# Altium schematic sheet ep4ce30_a.SchDoc: EP4CE30F23 - A
size OrCAD B; CheckedBy: liuchao; DrawnBy: liuchao; DocumentNumber: APEX-USB1; Revision: 3.0.0; SheetNumber: 1; SheetTotal: 9
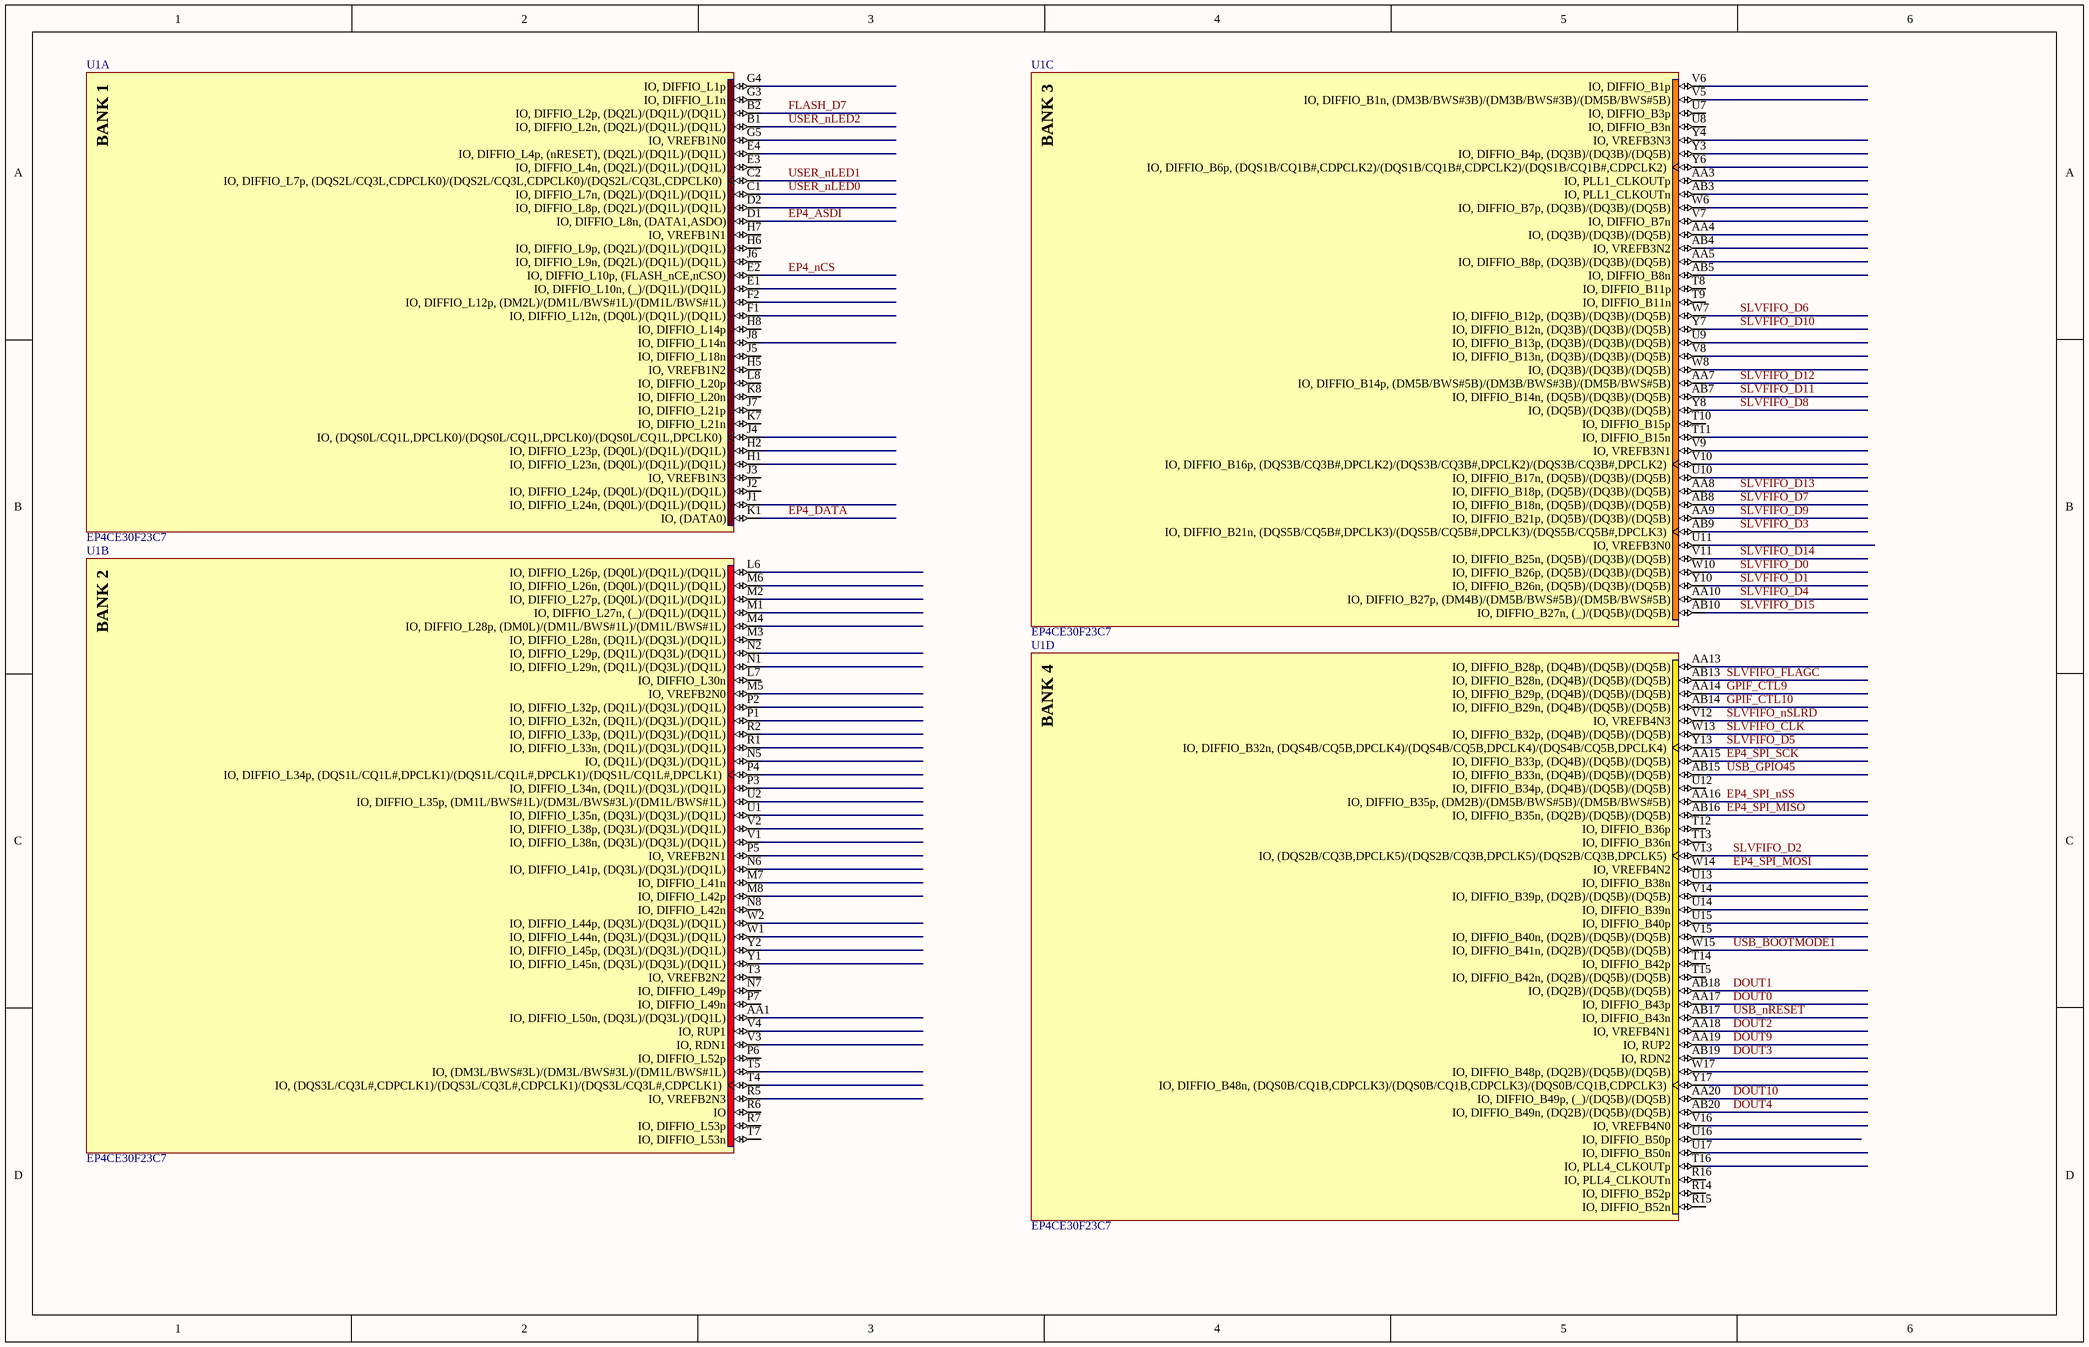
[diagram p0: ep4ce30_a.SchDoc]

## Parts
U1  EP4CE30F23C7  [FBGA484_A-240]  (parts A,B,C,D of 13)

## Nets
DOUT0: U1.AA17(IO,_DIFFIO_B43p)
DOUT1: U1.AB18(IO,_(DQ2B)/(DQ5B)/(DQ5B))
DOUT2: U1.AA18(IO,_VREFB4N1)
DOUT3: U1.AB19(IO,_RDN2)
DOUT4: U1.AB20(IO,_DIFFIO_B49n,_(DQ2B)/(DQ5B)/(DQ5B))
DOUT9: U1.AA19(IO,_RUP2)
DOUT10: U1.AA20(IO,_DIFFIO_B49p,_(_)/(DQ5B)/(DQ5B))
EP4_ASDI: U1.D1(IO,_DIFFIO_L8n,_(DATA1,ASDO))
EP4_DATA: U1.K1(IO,_(DATA0))
EP4_nCS: U1.E2(IO,_DIFFIO_L10p,_(FLASH_nCE,nCSO))
EP4_SPI_MISO: U1.AB16(IO,_DIFFIO_B35n,_(DQ2B)/(DQ5B)/(DQ5B))
EP4_SPI_MOSI: U1.W14(IO,_VREFB4N2)
EP4_SPI_nSS: U1.AA16(IO,_DIFFIO_B35p,_(DM2B)/(DM5B/BWS#5B)/(DM5B/BWS#5B))
EP4_SPI_SCK: U1.AA15(IO,_DIFFIO_B33p,_(DQ4B)/(DQ5B)/(DQ5B))
FLASH_D7: U1.B2(IO,_DIFFIO_L2p,_(DQ2L)/(DQ1L)/(DQ1L))
GPIF_CTL9: U1.AA14(IO,_DIFFIO_B29p,_(DQ4B)/(DQ5B)/(DQ5B))
GPIF_CTL10: U1.AB14(IO,_DIFFIO_B29n,_(DQ4B)/(DQ5B)/(DQ5B))
SLVFIFO_CLK: U1.W13(IO,_DIFFIO_B32p,_(DQ4B)/(DQ5B)/(DQ5B))
SLVFIFO_D0: U1.W10(IO,_DIFFIO_B26p,_(DQ5B)/(DQ3B)/(DQ5B))
SLVFIFO_D1: U1.Y10(IO,_DIFFIO_B26n,_(DQ5B)/(DQ3B)/(DQ5B))
SLVFIFO_D2: U1.V13(IO,_(DQS2B/CQ3B,DPCLK5)/(DQS2B/CQ3B,DPCLK5)/(DQS2B/CQ3B,DPCLK5))
SLVFIFO_D3: U1.AB9(IO,_DIFFIO_B21n,_(DQS5B/CQ5B#,DPCLK3)/(DQS5B/CQ5B#,DPCLK3)/(DQS5B/CQ5B#,DPCLK3))
SLVFIFO_D4: U1.AA10(IO,_DIFFIO_B27p,_(DM4B)/(DM5B/BWS#5B)/(DM5B/BWS#5B))
SLVFIFO_D5: U1.Y13(IO,_DIFFIO_B32n,_(DQS4B/CQ5B,DPCLK4)/(DQS4B/CQ5B,DPCLK4)/(DQS4B/CQ5B,DPCLK4))
SLVFIFO_D6: U1.W7(IO,_DIFFIO_B12p,_(DQ3B)/(DQ3B)/(DQ5B))
SLVFIFO_D7: U1.AB8(IO,_DIFFIO_B18n,_(DQ5B)/(DQ3B)/(DQ5B))
SLVFIFO_D8: U1.Y8(IO,_(DQ5B)/(DQ3B)/(DQ5B))
SLVFIFO_D9: U1.AA9(IO,_DIFFIO_B21p,_(DQ5B)/(DQ3B)/(DQ5B))
SLVFIFO_D10: U1.Y7(IO,_DIFFIO_B12n,_(DQ3B)/(DQ3B)/(DQ5B))
SLVFIFO_D11: U1.AB7(IO,_DIFFIO_B14n,_(DQ5B)/(DQ3B)/(DQ5B))
SLVFIFO_D12: U1.AA7(IO,_DIFFIO_B14p,_(DM5B/BWS#5B)/(DM3B/BWS#3B)/(DM5B/BWS#5B))
SLVFIFO_D13: U1.AA8(IO,_DIFFIO_B18p,_(DQ5B)/(DQ3B)/(DQ5B))
SLVFIFO_D14: U1.V11(IO,_DIFFIO_B25n,_(DQ5B)/(DQ3B)/(DQ5B))
SLVFIFO_D15: U1.AB10(IO,_DIFFIO_B27n,_(_)/(DQ5B)/(DQ5B))
SLVFIFO_FLAGC: U1.AB13(IO,_DIFFIO_B28n,_(DQ4B)/(DQ5B)/(DQ5B))
SLVFIFO_nSLRD: U1.V12(IO,_VREFB4N3)
USB_BOOTMODE1: U1.W15(IO,_DIFFIO_B41n,_(DQ2B)/(DQ5B)/(DQ5B))
USB_GPIO45: U1.AB15(IO,_DIFFIO_B33n,_(DQ4B)/(DQ5B)/(DQ5B))
USB_nRESET: U1.AB17(IO,_DIFFIO_B43n)
USER_nLED0: U1.C1(IO,_DIFFIO_L7n,_(DQ2L)/(DQ1L)/(DQ1L))
USER_nLED1: U1.C2(IO,_DIFFIO_L7p,_(DQS2L/CQ3L,CDPCLK0)/(DQS2L/CQ3L,CDPCLK0)/(DQS2L/CQ3L,CDPCLK0))
USER_nLED2: U1.B1(IO,_DIFFIO_L2n,_(DQ2L)/(DQ1L)/(DQ1L))

Not connected (* = marked no-connect by the designer): U1 AA1(IO,_DIFFIO_L50n,_(DQ3L)/(DQ3L)/(DQ1L)) AA3(IO,_PLL1_CLKOUTp) AA4(IO,_(DQ3B)/(DQ3B)/(DQ5B)) AA5(IO,_DIFFIO_B8p,_(DQ3B)/(DQ3B)/(DQ5B)) AA13(IO,_DIFFIO_B28p,_(DQ4B)/(DQ5B)/(DQ5B)) AB3(IO,_PLL1_CLKOUTn) AB4(IO,_VREFB3N2) AB5(IO,_DIFFIO_B8n) D2(IO,_DIFFIO_L8p,_(DQ2L)/(DQ1L)/(DQ1L)) E1(IO,_DIFFIO_L10n,_(_)/(DQ1L)/(DQ1L)) E3(IO,_DIFFIO_L4n,_(DQ2L)/(DQ1L)/(DQ1L)) E4(IO,_DIFFIO_L4p,_(nRESET),_(DQ2L)/(DQ1L)/(DQ1L)) F1(IO,_DIFFIO_L12n,_(DQ0L)/(DQ1L)/(DQ1L)) F2(IO,_DIFFIO_L12p,_(DM2L)/(DM1L/BWS#1L)/(DM1L/BWS#1L)) G3(IO,_DIFFIO_L1n) G4(IO,_DIFFIO_L1p) G5(IO,_VREFB1N0) H1(IO,_DIFFIO_L23n,_(DQ0L)/(DQ1L)/(DQ1L)) H2(IO,_DIFFIO_L23p,_(DQ0L)/(DQ1L)/(DQ1L)) H5(IO,_VREFB1N2) H6(IO,_DIFFIO_L9p,_(DQ2L)/(DQ1L)/(DQ1L)) H7(IO,_VREFB1N1) H8(IO,_DIFFIO_L14p) J1(IO,_DIFFIO_L24n,_(DQ0L)/(DQ1L)/(DQ1L)) J2(IO,_DIFFIO_L24p,_(DQ0L)/(DQ1L)/(DQ1L)) J3(IO,_VREFB1N3) J4(IO,_(DQS0L/CQ1L,DPCLK0)/(DQS0L/CQ1L,DPCLK0)/(DQS0L/CQ1L,DPCLK0)) J5(IO,_DIFFIO_L18n) J6(IO,_DIFFIO_L9n,_(DQ2L)/(DQ1L)/(DQ1L)) J7(IO,_DIFFIO_L21p) J8(IO,_DIFFIO_L14n) K7(IO,_DIFFIO_L21n) K8(IO,_DIFFIO_L20n) L6(IO,_DIFFIO_L26p,_(DQ0L)/(DQ1L)/(DQ1L)) L7(IO,_DIFFIO_L30n) L8(IO,_DIFFIO_L20p) M1(IO,_DIFFIO_L27n,_(_)/(DQ1L)/(DQ1L)) M2(IO,_DIFFIO_L27p,_(DQ0L)/(DQ1L)/(DQ1L)) M3(IO,_DIFFIO_L28n,_(DQ1L)/(DQ3L)/(DQ1L)) M4(IO,_DIFFIO_L28p,_(DM0L)/(DM1L/BWS#1L)/(DM1L/BWS#1L)) M5(IO,_VREFB2N0) M6(IO,_DIFFIO_L26n,_(DQ0L)/(DQ1L)/(DQ1L)) M7(IO,_DIFFIO_L41n) M8(IO,_DIFFIO_L42p) N1(IO,_DIFFIO_L29n,_(DQ1L)/(DQ3L)/(DQ1L)) N2(IO,_DIFFIO_L29p,_(DQ1L)/(DQ3L)/(DQ1L)) N5(IO,_(DQ1L)/(DQ3L)/(DQ1L)) N6(IO,_DIFFIO_L41p,_(DQ3L)/(DQ3L)/(DQ1L)) N7(IO,_DIFFIO_L49p) N8(IO,_DIFFIO_L42n) P1(IO,_DIFFIO_L32n,_(DQ1L)/(DQ3L)/(DQ1L)) P2(IO,_DIFFIO_L32p,_(DQ1L)/(DQ3L)/(DQ1L)) P3(IO,_DIFFIO_L34n,_(DQ1L)/(DQ3L)/(DQ1L)) P4(IO,_DIFFIO_L34p,_(DQS1L/CQ1L#,DPCLK1)/(DQS1L/CQ1L#,DPCLK1)/(DQS1L/CQ1L#,DPCLK1)) P5(IO,_VREFB2N1) P6(IO,_DIFFIO_L52p) P7(IO,_DIFFIO_L49n) R1(IO,_DIFFIO_L33n,_(DQ1L)/(DQ3L)/(DQ1L)) R2(IO,_DIFFIO_L33p,_(DQ1L)/(DQ3L)/(DQ1L)) R5(IO,_VREFB2N3) R6(IO) R7(IO,_DIFFIO_L53p) R14(IO,_DIFFIO_B52p) R15(IO,_DIFFIO_B52n) R16(IO,_PLL4_CLKOUTn) T3(IO,_VREFB2N2) T4(IO,_(DQS3L/CQ3L#,CDPCLK1)/(DQS3L/CQ3L#,CDPCLK1)/(DQS3L/CQ3L#,CDPCLK1)) T5(IO,_(DM3L/BWS#3L)/(DM3L/BWS#3L)/(DM1L/BWS#1L)) T7(IO,_DIFFIO_L53n) T8(IO,_DIFFIO_B11p) T9(IO,_DIFFIO_B11n) T10(IO,_DIFFIO_B15p) T11(IO,_DIFFIO_B15n) T12(IO,_DIFFIO_B36p) T13(IO,_DIFFIO_B36n) T14(IO,_DIFFIO_B42p) T15(IO,_DIFFIO_B42n,_(DQ2B)/(DQ5B)/(DQ5B)) T16(IO,_PLL4_CLKOUTp) U1(IO,_DIFFIO_L35n,_(DQ3L)/(DQ3L)/(DQ1L)) U2(IO,_DIFFIO_L35p,_(DM1L/BWS#1L)/(DM3L/BWS#3L)/(DM1L/BWS#1L)) U7(IO,_DIFFIO_B3p) U8(IO,_DIFFIO_B3n) U9(IO,_DIFFIO_B13p,_(DQ3B)/(DQ3B)/(DQ5B)) U10(IO,_DIFFIO_B17n,_(DQ5B)/(DQ3B)/(DQ5B)) U11(IO,_VREFB3N0) U12(IO,_DIFFIO_B34p,_(DQ4B)/(DQ5B)/(DQ5B)) U13(IO,_DIFFIO_B38n) U14(IO,_DIFFIO_B39n) U15(IO,_DIFFIO_B40p) U16(IO,_DIFFIO_B50p) U17(IO,_DIFFIO_B50n) V1(IO,_DIFFIO_L38n,_(DQ3L)/(DQ3L)/(DQ1L)) V2(IO,_DIFFIO_L38p,_(DQ3L)/(DQ3L)/(DQ1L)) V3(IO,_RDN1) V4(IO,_RUP1) V5(IO,_DIFFIO_B1n,_(DM3B/BWS#3B)/(DM3B/BWS#3B)/(DM5B/BWS#5B)) V6(IO,_DIFFIO_B1p) V7(IO,_DIFFIO_B7n) V8(IO,_DIFFIO_B13n,_(DQ3B)/(DQ3B)/(DQ5B)) V9(IO,_VREFB3N1) V10(IO,_DIFFIO_B16p,_(DQS3B/CQ3B#,DPCLK2)/(DQS3B/CQ3B#,DPCLK2)/(DQS3B/CQ3B#,DPCLK2)) V14(IO,_DIFFIO_B39p,_(DQ2B)/(DQ5B)/(DQ5B)) V15(IO,_DIFFIO_B40n,_(DQ2B)/(DQ5B)/(DQ5B)) V16(IO,_VREFB4N0) W1(IO,_DIFFIO_L44n,_(DQ3L)/(DQ3L)/(DQ1L)) W2(IO,_DIFFIO_L44p,_(DQ3L)/(DQ3L)/(DQ1L)) W6(IO,_DIFFIO_B7p,_(DQ3B)/(DQ3B)/(DQ5B)) W8(IO,_(DQ3B)/(DQ3B)/(DQ5B)) W17(IO,_DIFFIO_B48p,_(DQ2B)/(DQ5B)/(DQ5B)) Y1(IO,_DIFFIO_L45n,_(DQ3L)/(DQ3L)/(DQ1L)) Y2(IO,_DIFFIO_L45p,_(DQ3L)/(DQ3L)/(DQ1L)) Y3(IO,_DIFFIO_B4p,_(DQ3B)/(DQ3B)/(DQ5B)) Y4(IO,_VREFB3N3) Y6(IO,_DIFFIO_B6p,_(DQS1B/CQ1B#,CDPCLK2)/(DQS1B/CQ1B#,CDPCLK2)/(DQS1B/CQ1B#,CDPCLK2)) Y17(IO,_DIFFIO_B48n,_(DQS0B/CQ1B,CDPCLK3)/(DQS0B/CQ1B,CDPCLK3)/(DQS0B/CQ1B,CDPCLK3))

## Notes on the sheet
- (in symbol EP4CE30F23C7, part A) BANK 1
- (in symbol EP4CE30F23C7, part B) BANK 2
- (in symbol EP4CE30F23C7, part C) BANK 3
- (in symbol EP4CE30F23C7, part D) BANK 4

## Library data of the parts
U1 = EP4CE30F23C7: Cyclone IV Family FPGA, 1.2V Core, 328 I/O Pins, 4 PLLs, 484-Pin FBGA, Speed Grade 7, Commercial Grade; Manufacturer: Altera; DatasheetVersion: ver1.6, Nov-2011; PackageVersion: ver1.0, Jun-2011; PackageReference: FBGA484_A-240; PackageDescription: 484-Pin FineLine Ball Grid Array (FBGA) - Wire Bond - A:2.40; Code_JEDEC: MS-034-AAJ-1; ComponentLink1Description: Manufacturer URL; ComponentLink1URL: http://www.altera.com/; ComponentLink2Description: Handbook; ComponentLink2URL: http://www.altera.com/literature/hb/cyclone-iv/cyclone4-handbook.pdf; ComponentLink3Description: Pinout; ComponentLink3URL: http://www.altera.com/literature/lit-dp.jsp?category=cyc%204&showspreadsheet=y; ComponentLink4Description: Package Specification; ComponentLink4URL: http://www.altera.com/devicepackaging/04R00247-02.pdf